# Altium schematic sheet Board-PCB.SchDoc: Bison-Board
size A4; DrawnBy: mzy2364; Revision: V1.4
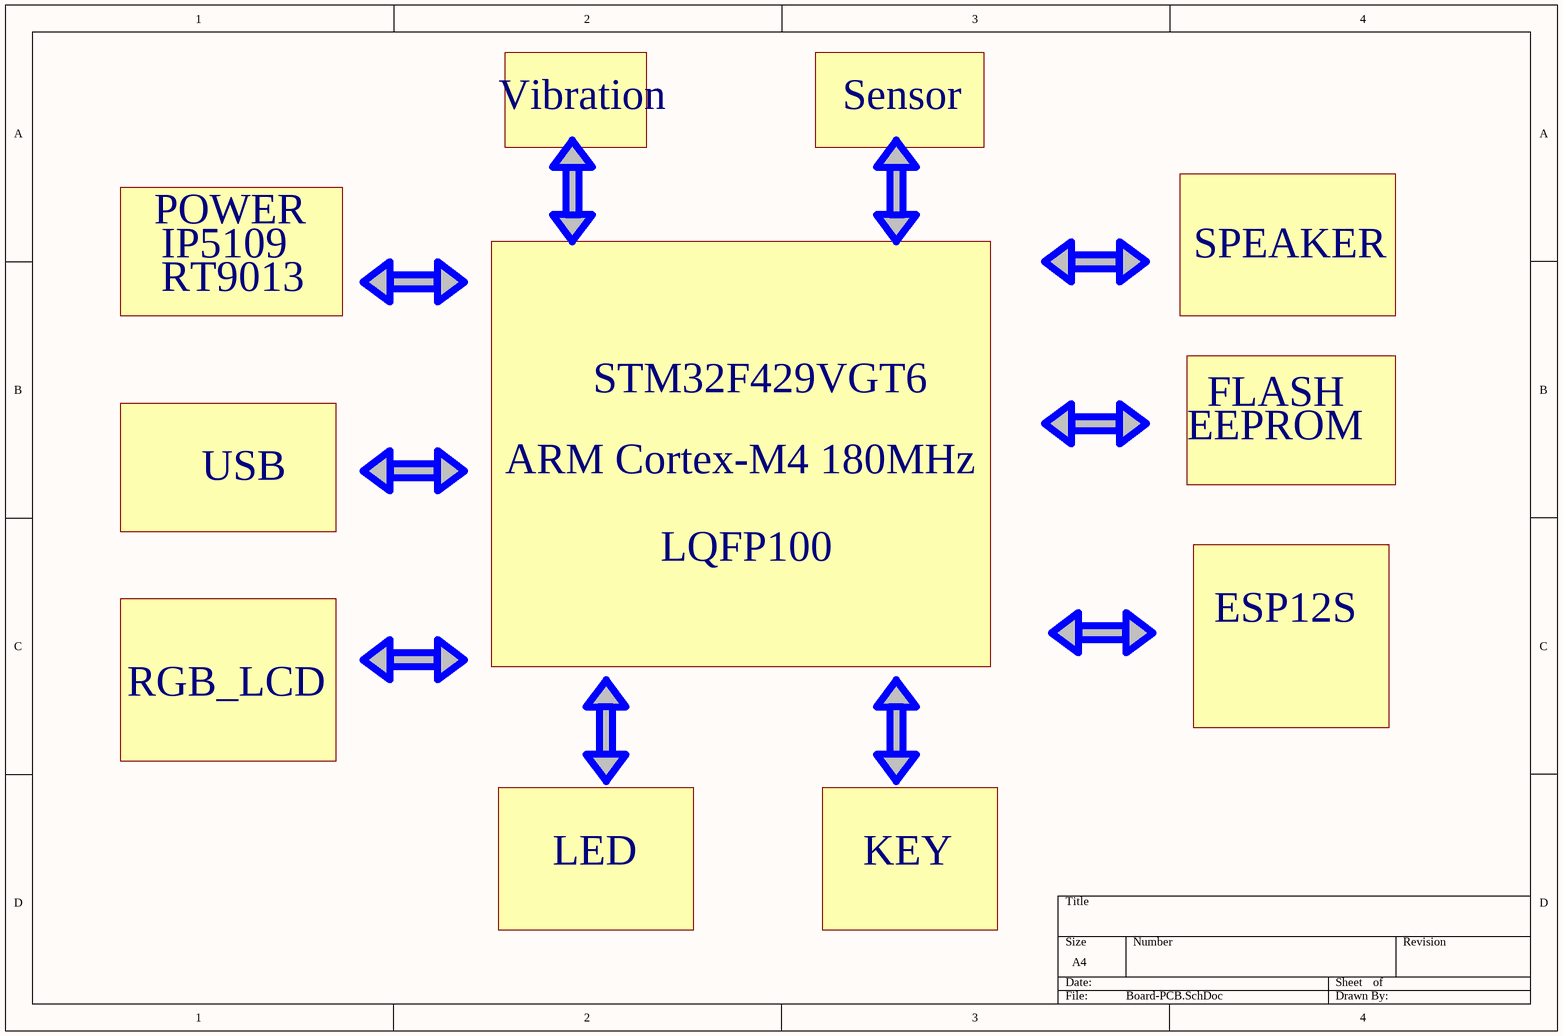
[diagram p0: Board-PCB.SchDoc]

## Notes on the sheet
- Vibration
- Sensor
- POWER
- IP5109
- RT9013
- SPEAKER
- STM32F429VGT6
- EEPROM
- FLASH
- USB
- ARM Cortex-M4 180MHz
- LQFP100
- ESP12S
- RGB_LCD
- LED
- KEY